# EAGLE schematic FPGA_NES_controller (EAGLE 6.3)
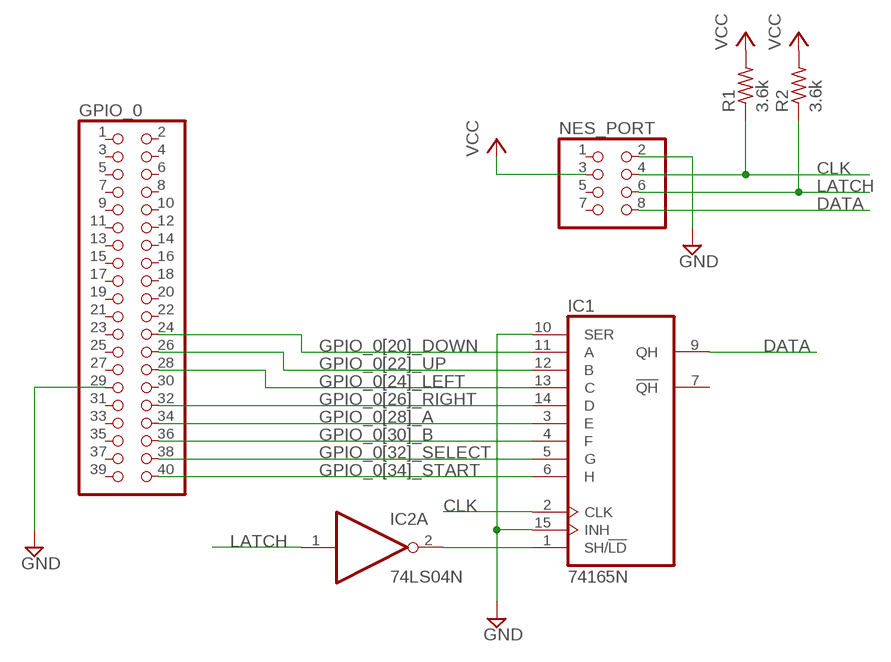
[diagram p0: schematic, sheet 1]

## Parts
GPIO_0  PINHD-2X20  [2X20]
IC1  74165N  [DIL16]
IC2  74LS04N  [DIL14]
NES_PORT  PINHD-2X4  [2X04]
R1  3.6k  R-US_V526-0  [V526-0]
R2  3.6k  R-US_V526-0  [V526-0]

## Nets
CLK: IC1.2(CLK) NES_PORT.4 R1.1
DATA: IC1.9(QH) NES_PORT.8
GND: GPIO_0.29 IC1.10(SER) IC1.15(INH) NES_PORT.2
GPIO_0[20]_DOWN: GPIO_0.24 IC1.11(A)
GPIO_0[22]_UP: GPIO_0.26 IC1.12(B)
GPIO_0[24]_LEFT: GPIO_0.28 IC1.13(C)
GPIO_0[26]_RIGHT: GPIO_0.32 IC1.14(D)
GPIO_0[28]_A: GPIO_0.34 IC1.3(E)
GPIO_0[30]_B: GPIO_0.36 IC1.4(F)
GPIO_0[32]_SELECT: GPIO_0.38 IC1.5(G)
GPIO_0[34]_START: GPIO_0.40 IC1.6(H)
LATCH: IC2.1(A:I) NES_PORT.6 R2.1
N$6: IC1.1(SH/!LD) IC2.2(A:O)
VCC: NES_PORT.3 R1.2 R2.2
Unconnected: GPIO_0.1 GPIO_0.2 GPIO_0.3 GPIO_0.4 GPIO_0.5 GPIO_0.6 GPIO_0.7 GPIO_0.8 GPIO_0.9 GPIO_0.10 GPIO_0.11 GPIO_0.12 GPIO_0.13 GPIO_0.14 GPIO_0.15 GPIO_0.16 GPIO_0.17 GPIO_0.18 GPIO_0.19 GPIO_0.20 GPIO_0.21 GPIO_0.22 GPIO_0.23 GPIO_0.25 GPIO_0.27 GPIO_0.30 GPIO_0.31 GPIO_0.33 GPIO_0.35 GPIO_0.37 GPIO_0.39 IC1.7(!QH) IC2.3(B:I) IC2.4(B:O) IC2.5(C:I) IC2.6(C:O) IC2.8(D:O) IC2.9(D:I) IC2.10(E:O) IC2.11(E:I) IC2.12(F:O) IC2.13(F:I) NES_PORT.1 NES_PORT.5 NES_PORT.7

## Power pins joined to a net without a drawn wire
GND: IC1.8(GND) IC2.7(P:GND)
VCC: IC1.16(VCC) IC2.14(P:VCC)

## Library data of the parts
GPIO_0 = pinhead:PINHD-2X20: PIN HEADER
IC1 = 74xx-us:74*165: 8-bit parallel load SHIFT REGISTER
IC2 = 74xx-us:74*04: Hex INVERTER
NES_PORT = pinhead:PINHD-2X4: PIN HEADER
R1 R2 = rcl:R-US_: RESISTOR, American symbol